# EAGLE design Lock_in (EAGLE 6.4)
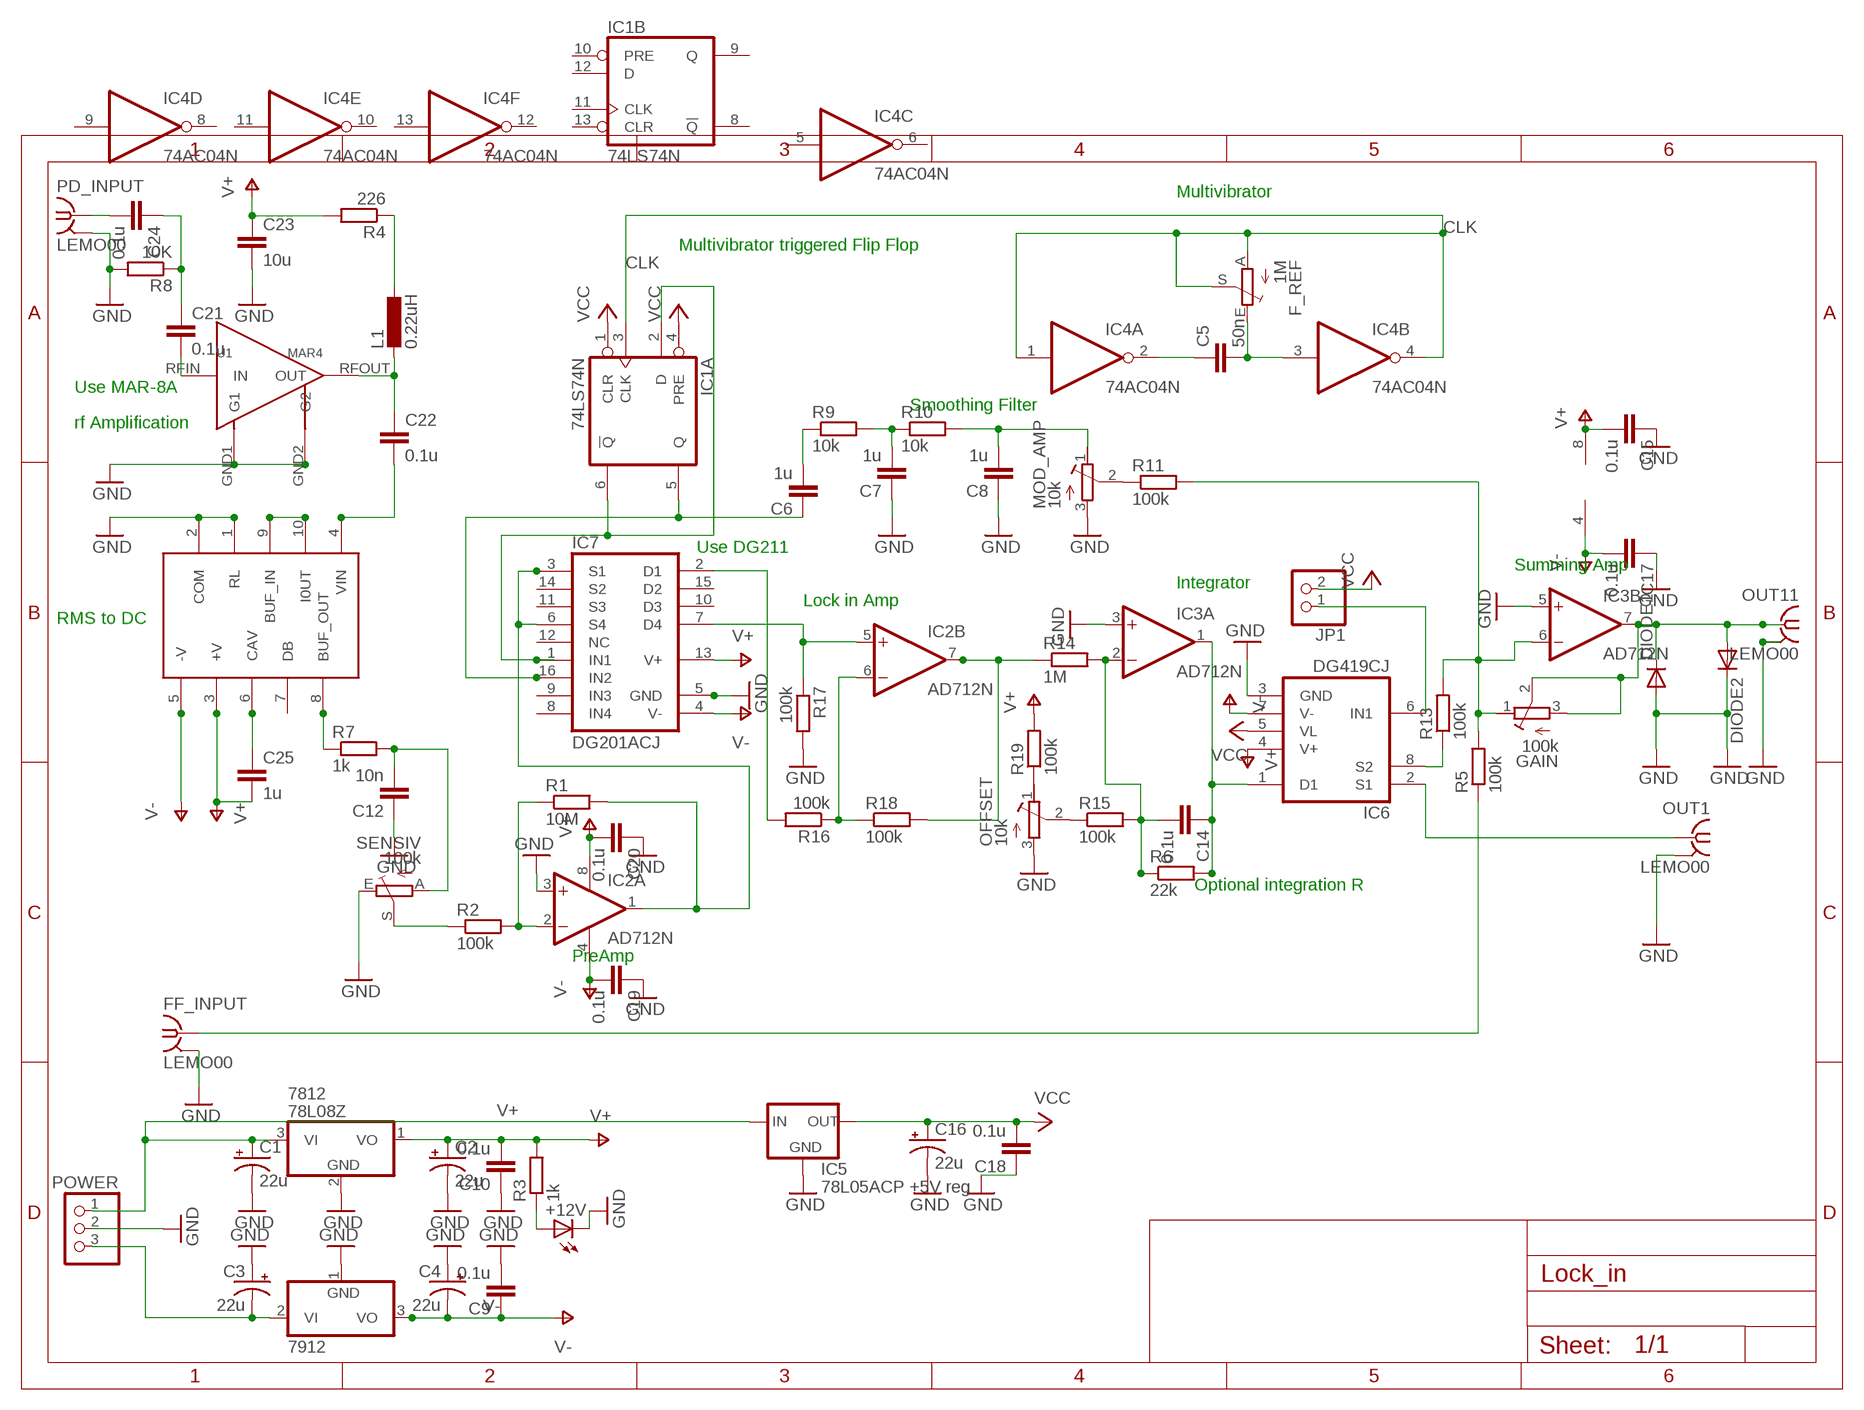
[diagram p0: schematic, sheet 1]

## Parts
7812  78L08Z  [TO92]
7912  79L12Z  [TO92]
+12V  LED5MM  [LED5MM]
C1  22u  CPOL-USE5-4  [E5-4]
C2  22u  CPOL-USE5-4  [E5-4]
C3  22u  CPOL-USE5-4  [E5-4]
C4  22u  CPOL-USE5-4  [E5-4]
C5  50n  C-EU050-024X044  [C050-024X044]
C6  1u  C-EU050-024X044  [C050-024X044]
C7  1u  C-EU050-024X044  [C050-024X044]
C8  1u  C-EU050-024X044  [C050-024X044]
C9  0.1u  C-EU050-024X044  [C050-024X044]
C10  0.1u  C-EU050-024X044  [C050-024X044]
C12  10n  C-EU050-024X044  [C050-024X044]
C14  0.1u  C-EU050-024X044  [C050-024X044]
C15  0.1u  C-EU050-024X044  [C050-024X044]
C16  22u  CPOL-USE5-4  [E5-4]
C17  0.1u  C-EU050-024X044  [C050-024X044]
C18  0.1u  C-EU050-024X044  [C050-024X044]
C19  0.1u  C-EU050-024X044  [C050-024X044]
C20  0.1u  C-EU050-024X044  [C050-024X044]
C21  0.1u  C-EUC0805  [C0805]
C22  0.1u  C-EUC0805  [C0805]
C23  10u  C-EUC1206  [C1206]
C24  0.1u  C-EUC0805  [C0805]
C25  1u  C-EUC0805  [C0805]
DIODE1  1N4004  [DO41-10]
DIODE2  1N4004  [DO41-10]
F_REF  1M  TRIM_EU-S63P  [S63P]
FF_INPUT  LEMO00  [LEMOPAC.PAC]
GAIN  100k  R-TRIMM43P  [RTRIM43P]
IC1  74LS74N  [DIL14]
IC2  AD712N  [DIL08]
IC3  AD712N  [DIL08]
IC4  74AC04N  [DIL14]
IC5  78L05ACP +5V reg  78LXX  [78LXX]
IC6  DG419CJ  [DIL08]
IC7  DG201ACJ  [DIL16]
JP1  PINHD-1X2  [1X02]
L1  0.22uH  L-EUL3216C  [L3216C]
MOD_AMP  10k  R-TRIMM43P  [RTRIM43P]
OFFSET  10k  R-TRIMM43P  [RTRIM43P]
OUT1  LEMO00  [LEMOPAC.PAC]
OUT11  LEMO00  [LEMOPAC.PAC]
PD_INPUT  LEMO00  [LEMOPAC.PAC]
POWER  PINHD-1X3  [1X03]
R1  10M  R-EU_0204/7  [0204/7]
R2  100k  R-EU_0204/7  [0204/7]
R3  1k  R-EU_0204/7  [0204/7]
R4  226  R-EU_R1206  [R1206]
R5  100k  R-EU_0204/7  [0204/7]
R6  22k  R-EU_0204/7  [0204/7]
R7  1k  R-EU_0204/7  [0204/7]
R8  10K  R-EU_R1206  [R1206]
R9  10k  R-EU_0204/7  [0204/7]
R10  10k  R-EU_0204/7  [0204/7]
R11  100k  R-EU_0204/7  [0204/7]
R13  100k  R-EU_0204/7  [0204/7]
R14  1M  R-EU_0204/7  [0204/7]
R15  100k  R-EU_0204/7  [0204/7]
R16  100k  R-EU_0204/7  [0204/7]
R17  100k  R-EU_0204/7  [0204/7]
R18  100k  R-EU_0204/7  [0204/7]
R19  100k  R-EU_0204/7  [0204/7]
SENSIV  100k  TRIM_EU-S63P  [S63P]
U1  MAR4  [VV105]
U$1  AD636  [TO100]

## Nets
CLK: F_REF.A F_REF.S IC1.3(A:CLK) IC4.1(A:I) IC4.4(B:O)
F2: C6.1 IC1.5(A:Q) IC7.16(IN2)
GND: 7812.2(GND) 7912.1(GND) +12V.K(C) C1.- C2.- C3.+ C4.+ C7.1 C8.1 C9.2 C10.1 C12.1 C15.1 C16.- C17.1 C18.1 C19.1 C20.1 C23.2 DIODE1.A DIODE2.C FF_INPUT.2(GND) FF_INPUT.3(GND) FF_INPUT.4(GND) FF_INPUT.5(GND) IC2.3(A:+IN) IC3.3(A:+IN) IC3.5(B:+IN) IC5.GND IC6.3(GND) IC7.5(GND) MOD_AMP.3(E) OFFSET.3(E) OUT1.2(GND) OUT1.3(GND) OUT1.4(GND) OUT1.5(GND) OUT11.2(GND) OUT11.3(GND) OUT11.4(GND) OUT11.5(GND) PD_INPUT.2(GND) PD_INPUT.3(GND) PD_INPUT.4(GND) PD_INPUT.5(GND) POWER.2 R8.2 R17.2 SENSIV.E U1.GND1(G1) U1.GND2(G2) U$1.1(RL) U$1.2(COM)
GND1: IC6.6(IN1) JP1.1
MOD_AMPLITUDE: C8.2 MOD_AMP.1(A) R10.2
N$1: C5.1 IC4.2(A:O)
N$2: +12V.A R3.1
N$3: DIODE1.C DIODE2.A GAIN.2(S) GAIN.3(E) IC3.7(B:OUT) OUT11.1
N$4: IC2.2(A:-IN) R1.1 R2.2
N$5: C5.2 F_REF.E IC4.3(B:I)
N$6: R2.1 SENSIV.S
N$9: C12.2 R7.2 SENSIV.A
N$10: R7.1 U$1.8(BUF_OUT)
N$12: C6.2 R9.1
N$13: C7.2 R9.2 R10.1
N$14: GAIN.1(A) IC3.6(B:-IN) R5.2 R11.2 R13.2
N$15: MOD_AMP.2(S) R11.1
N$16: IC2.1(A:OUT) IC7.3(S1) IC7.6(S4) R1.2
N$18: OFFSET.1(A) R19.1
N$19: IC6.8(S2) R13.1
N$20: IC1.2(A:D) IC1.6(A:!Q) IC7.1(IN1)
N$21: C14.2 IC3.2(A:-IN) R6.1 R14.2 R15.2
N$22: IC7.2(D1) R16.2
N$23: IC2.5(B:+IN) IC7.7(D4) R17.1
N$24: IC2.6(B:-IN) R16.1 R18.1
N$25: IC2.7(B:OUT) R14.1 R18.2
N$26: OFFSET.2(S) R15.1
N$27: C21.2 U1.RFIN(IN)
N$28: C14.1 IC3.1(A:OUT) IC6.1(D1) R6.2
N$29: L1.1 R4.1
N$30: C22.1 L1.2 U1.RFOUT(OUT)
N$32: C24.2 PD_INPUT.1
N$33: C21.1 C24.1 R8.1
N$34: C22.2 U$1.4(VIN)
N$35: IC6.2(S1) OUT1.1
N$37: U$1.9(BUF_IN) U$1.10(I0UT)
N$38: C25.1 U$1.6(CAV)
OUT: FF_INPUT.1 R5.1
V+: 7812.1(VO) C2.+ C10.2 C15.2 C20.2 C23.1 C25.2 IC2.8(P:V+) IC3.8(P:V+) IC6.4(V+) IC7.13(V+) R3.2 R4.2 R19.2 U$1.3(+V)
V+INPUT: 7812.3(VI) C1.+ IC5.IN POWER.1
V-: 7912.3(VO) C4.- C9.1 C17.2 C19.2 IC2.4(P:V-) IC3.4(P:V-) IC6.7(V-) IC7.4(V-) U$1.5(-V)
V-INPUT: 7912.2(VI) C3.- POWER.3
VCC: C16.+ C18.2 IC1.1(A:CLR) IC1.4(A:PRE) IC5.OUT IC6.5(VL) JP1.2
Unconnected: IC1.8(B:!Q) IC1.9(B:Q) IC1.10(B:PRE) IC1.11(B:CLK) IC1.12(B:D) IC1.13(B:CLR) IC4.5(C:I) IC4.6(C:O) IC4.8(D:O) IC4.9(D:I) IC4.10(E:O) IC4.11(E:I) IC4.12(F:O) IC4.13(F:I) IC7.8(IN4) IC7.9(IN3) IC7.10(D3) IC7.11(S3) IC7.12(NC) IC7.14(S2) IC7.15(D2) U$1.7(DB)

## Notes on the sheet
- Multivibrator
- Multivibrator triggered Flip Flop
- Use MAR-8A
- Smoothing Filter
- rf Amplification
- Use DG211
- Summing Amp
- Integrator
- Lock in Amp
- RMS to DC
- Optional integration R
- PreAmp

## Power pins joined to a net without a drawn wire
GND: IC1.7(P:GND) IC4.7(P:GND)
VCC: IC1.14(P:VCC) IC4.14(P:VCC)

## Library data of the parts
7812 = linear:78*: Positive VOLTAGE REGULATOR Source: http://cache.national.com/ds/LM/LM78L05.pdf http://www.fairchildsemi.com/ds/LM/LM7805.pdf
7912 = linear:79*: Negative VOLTAGE REGULATOR
+12V = led:LED: LED OSRAM: - CHIPLED LG R971, LG N971, LY N971, LG Q971, LY Q971, LO R971, LY R971 LH N974, LH R974 LS Q976, LO Q976, LY Q976 LO Q996 - Hyper CHIPLED LW Q18S LB Q993, LB Q99A, LB R99A - SideLED LS A670, LO A670, LY A670, LG A670, LP A670 LB A673, LV A673, LT A673, LW A673 LH A674 LY A675 LS A676, LA A676, LO A676, LY A676, LW A676 LS A679, LY A679, LG A679 - Hyper Micro SIDELED® LS Y876, LA Y876, LO Y876, LY Y876 LT Y87S - SmartLED LW L88C, LW L88S LB L89C, LB L89S, LG L890 LS L89K, LO L89K, LY L89K LS L896, LA L896, LO L896, LY L896 - TOPLED LS T670, LO T670, LY T670, LG T670, LP T670 LSG T670, LSP T670, LSY T670, LOP T670, LYG T670 LG T671, LOG T671, LSG T671 LB T673, LV T673, LT T673, LW T673 LH T674 LS T676, LA T676, LO T676, LY T676, LB T676, LH T676, LSB T676, LW T676 LB T67C, LV T67C, LT T67C, LS T67K, LO T67K, LY T67K, LW E67C LS E67B, LA E67B, LO E67B, LY E67B, LB E67C, LV E67C, LT E67C LW T67C LS T679, LY T679, LG T679 LS T770, LO T770, LY T770, LG T770, LP T770 LB T773, LV T773, LT T773, LW T773 LH T774 LS E675, LA E675, LY E675, LS T675 LS T776, LA T776, LO T776, LY T776, LB T776 LHGB T686 LT T68C, LB T68C - Hyper Mini TOPLED® LB M676 - Mini TOPLED Santana® LG M470 LS M47K, LO M47K, LY M47K Source: http://www.osram.convergy.de LUXEON: - LUMILED® LXK2-PW12-R00, LXK2-PW12-S00, LXK2-PW14-U00, LXK2-PW14-V00 LXK2-PM12-R00, LXK2-PM12-S00, LXK2-PM14-U00 LXK2-PE12-Q00, LXK2-PE12-R00, LXK2-PE12-S00, LXK2-PE14-T00, LXK2-PE14-U00 LXK2-PB12-K00, LXK2-PB12-L00, LXK2-PB12-M00, LXK2-PB14-N00, LXK2-PB14-P00, LXK2-PB14-Q00 LXK2-PR12-L00, LXK2-PR12-M00, LXK2-PR14-Q00, LXK2-PR14-R00 LXK2-PD12-Q00, LXK2-PD12-R00, LXK2-PD12-S00 LXK2-PH12-R00, LXK2-PH12-S00 LXK2-PL12-P00, LXK2-PL12-Q00, LXK2-PL12-R00 Source: www.luxeon.com KINGBRIGHT: KA-3528ASYC Source: www.kingbright.com
C1-C4 C16 = rcl:CPOL-US: POLARIZED CAPACITOR, American symbol
C5-C10 C12 C14 C15 C17-C25 = rcl:C-EU: CAPACITOR, European symbol
DIODE1 DIODE2 = diode:1N4004: DIODE general purpose rectifier, 1 A
F_REF SENSIV = pot:TRIM_EU-: POTENTIOMETER
FF_INPUT OUT1 OUT11 PD_INPUT = con-coax:LEMO00
GAIN MOD_AMP OFFSET = resistor:R-TRIMM: Trimm resistor
IC1 = 74xx-eu:74*74: Dual D type positive edge triggered FLIP FLOP, preset and clear
IC2 IC3 = linear:AD712: OP AMP
IC4 = 74xx-eu:74*04: Hex INVERTER
IC5 = v-reg:78LXX: VOLTAGE REGULATOR
IC6 = maxim:DG419CJ: ANALOG SWITCH; MF: MAXIM; MPN: DG419CJ; OC_FARNELL: unknown; OC_NEWARK: 77C6520
IC7 = maxim:DG201ACJ: ANALOG SWITCH; MPN: DG201ACJ; OC_FARNELL: unknown; OC_NEWARK: 06F3941
JP1 = pinhead:PINHD-1X2: PIN HEADER
L1 = rcl:L-EU: INDUCTOR, European symbol
POWER = pinhead:PINHD-1X3: PIN HEADER
R1-R11 R13-R19 = rcl:R-EU_: RESISTOR, European symbol
U1 = custom_parts:MAR4: MiniCircuits MAR4 (and other) amplifier
U$1 = analog-devices:AD636

## Board
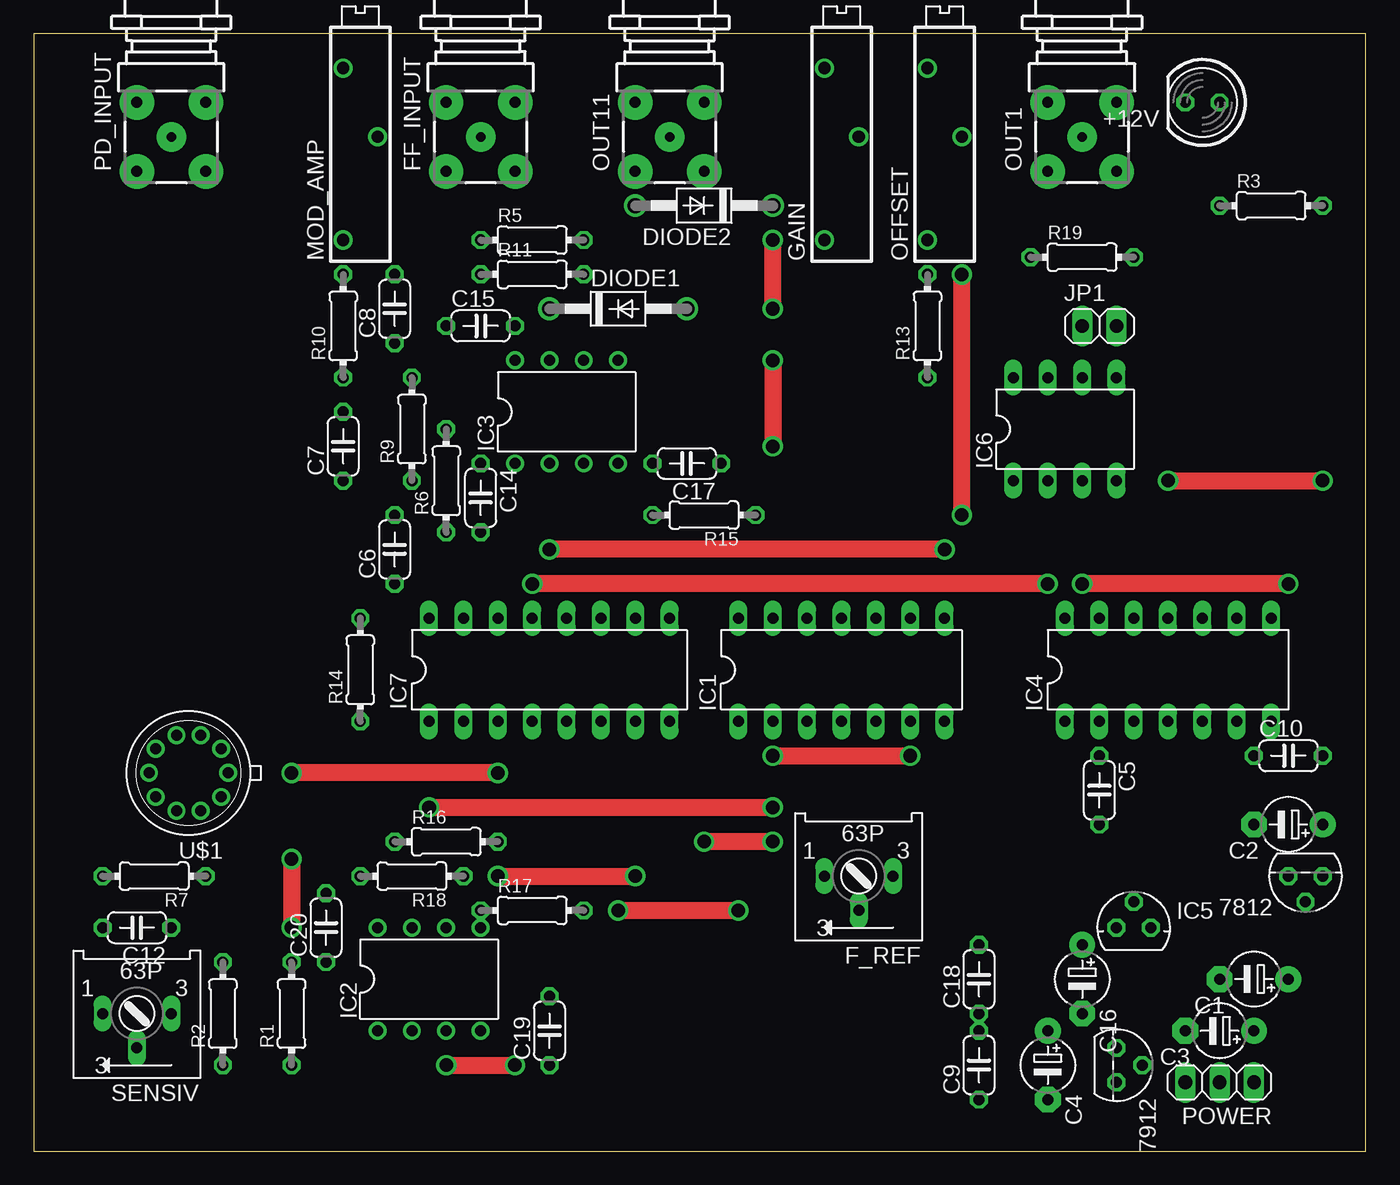
[diagram p1: board, top side]
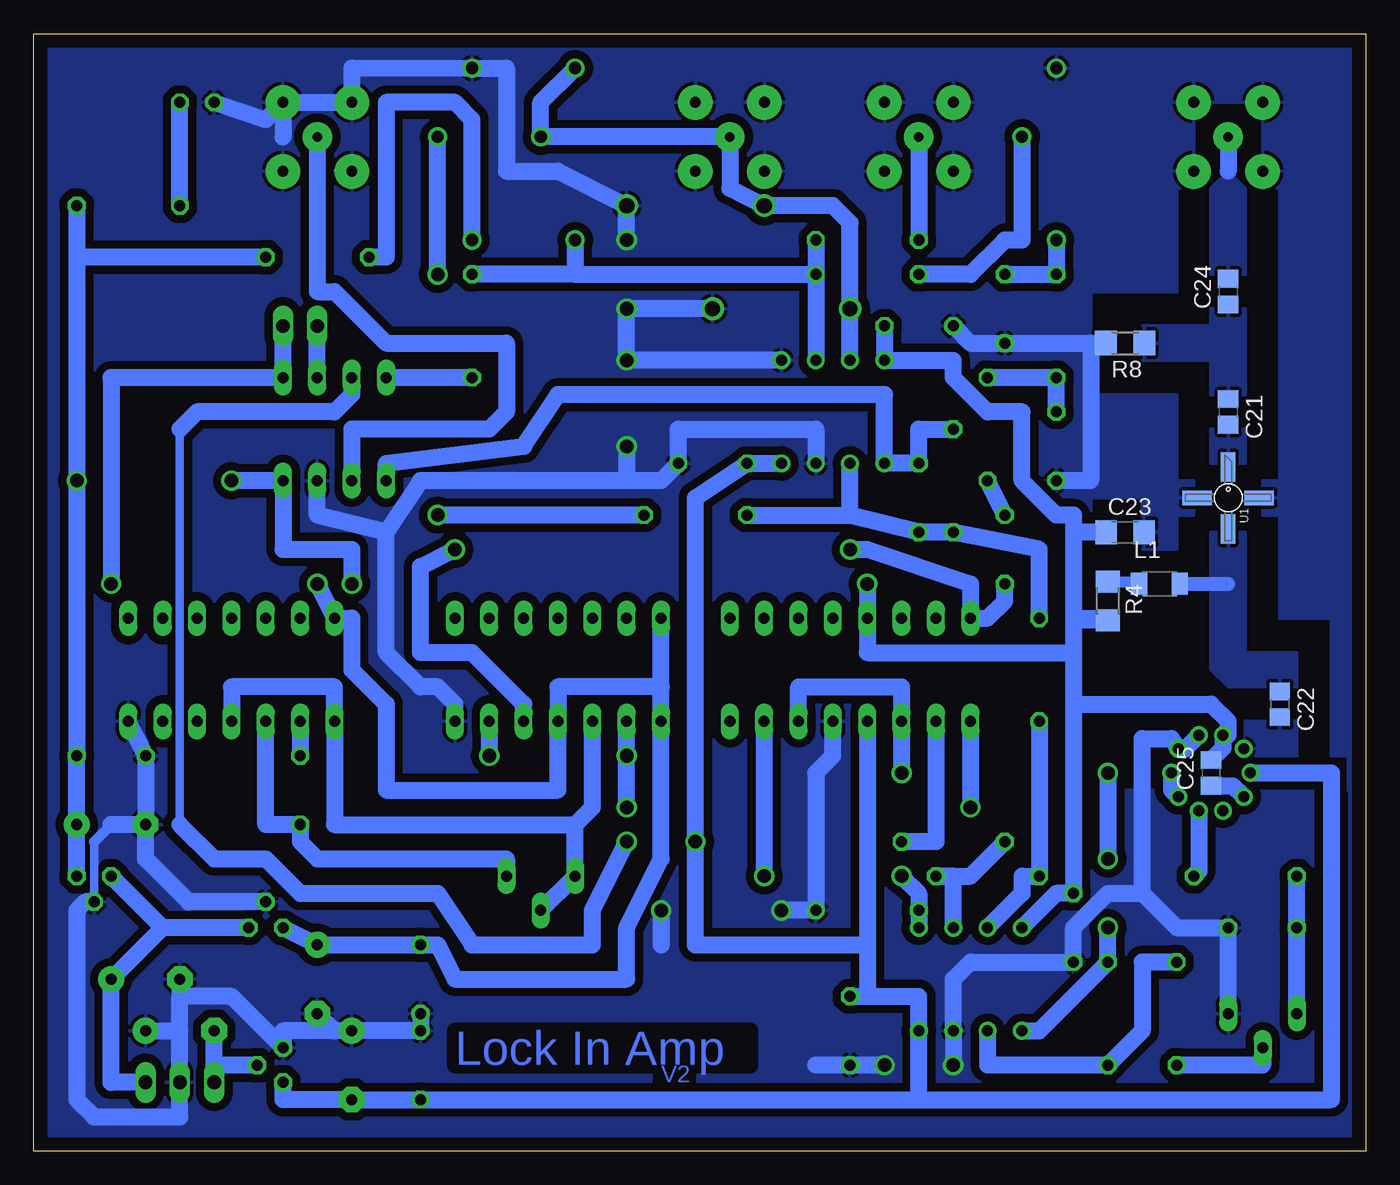
[diagram p2: board, bottom side, seen from below]

Size 98.42 x 82.54 mm. Coordinates in mm from the lower left corner, seen from the top.
Outline: 0,0 98.42,0 98.42,82.54 0,82.54 0,0
Copper layers (1*16): Top 0.035mm / dielectric 1.5mm / Bottom 0.035mm
Design rules "default": minimum track width 10mil, minimum drill 24mil, track to track 8mil, track to pad 8mil, pad to pad 8mil, via to via 8mil, smd to smd 8mil, copper to edge 40mil, drill to drill 8mil, minimum pad ring 10mil, minimum via ring 8mil, stop-mask expansion 4mil, vias tented up to drill 0mil, thermal gap 10mil

### Footprints (pad centres in the part's own frame; a part is rotated, then mirrored left to right if it is on the bottom)
TO92 = drill 0.813 octagon: 1 -1.27,0; 2 0,1.905; 3 1.27,0
LED5MM = drill 0.813 octagon: A -1.27,0; K 1.27,0
E5-4 = drill 0.813 pad 1.905: + -2.54,0 | drill 0.813 pad 1.905 octagon: - 2.54,0
C050-024X044 = drill 0.813 octagon: 1 -2.54,0; 2 2.54,0
C0805 = smd 1.3 x 1.5: 1 -0.95,0; 2 0.95,0
C1206 = smd 1.6 x 1.8: 1 -1.4,0; 2 1.4,0
DO41-10 = drill 1.118: A 5.08,0; C -5.08,0
S63P = drill 0.813 long: A 2.54,0; E -2.54,0; S 0,2.54
LEMOPAC.PAC = drill 0.7 pad 2.184: 1 0,0 | drill 0.8 pad 2.54: 2 -2.55,2.55; 3 2.55,2.55; 4 2.55,-2.55; 5 -2.55,-2.55
RTRIM43P = drill 0.9: 1 -7.62,1.27; 2 0,-1.27; 3 5.08,1.27
DIL14 = drill 0.813 long: 1 -7.62,-3.81; 2 -5.08,-3.81; 3 -2.54,-3.81; 4 0,-3.81; 5 2.54,-3.81; 6 5.08,-3.81; 7 7.62,-3.81; 8 7.62,3.81; 9 5.08,3.81; 10 2.54,3.81; 11 0,3.81; 12 -2.54,3.81; 13 -5.08,3.81; 14 -7.62,3.81
DIL08 = drill 0.813 pad 1.27: 1 -3.81,-3.81; 2 -1.27,-3.81; 3 1.27,-3.81; 4 3.81,-3.81; 5 3.81,3.81; 6 1.27,3.81; 7 -1.27,3.81; 8 -3.81,3.81
78LXX = drill 0.813 octagon: GND 0,1.905; IN 1.27,0; OUT -1.27,0
DIL08' = drill 0.813 long: 1 -3.81,-3.81; 2 -1.27,-3.81; 3 1.27,-3.81; 4 3.81,-3.81; 5 3.81,3.81; 6 1.27,3.81; 7 -1.27,3.81; 8 -3.81,3.81
DIL16 = drill 0.813 long: 1 -8.89,-3.81; 2 -6.35,-3.81; 3 -3.81,-3.81; 4 -1.27,-3.81; 5 1.27,-3.81; 6 3.81,-3.81; 7 6.35,-3.81; 8 8.89,-3.81; 9 8.89,3.81; 10 6.35,3.81; 11 3.81,3.81; 12 1.27,3.81; 13 -1.27,3.81; 14 -3.81,3.81; 15 -6.35,3.81; 16 -8.89,3.81
1X02 = drill 1.016 long: 1 -1.27,0; 2 1.27,0
L3216C = smd 1.2 x 1.6: 1 -1.5,0; 2 1.5,0
1X03 = drill 1.016 long: 1 -2.54,0; 2 0,0; 3 2.54,0
0204/7 = drill 0.813 octagon: 1 -3.81,0; 2 3.81,0
R1206 = smd 1.6 x 1.803: 1 -1.422,0; 2 1.422,0
VV105 = smd 1.067 x 2.184: GND1 0,2.286; GND2 0,-2.286 | smd 2.184 x 1.067: RFIN -2.286,0; RFOUT 2.286,0
TO100 = drill 0.813: 1 -2.413,-1.778; 2 -0.889,-2.794; 3 0.889,-2.794; 4 2.413,-1.778; 5 2.921,0; 6 2.413,1.778; 7 0.889,2.794; 8 -0.889,2.794; 9 -2.413,1.778; 10 -2.921,0

### Placement (x,y rotation side)
7812  93.98,20.32 180 top
7912  80.01,6.35 270 top
+12V  86.36,77.47 180 top
C1  90.17,12.7 180 top
C2  92.71,24.13 180 top
C3  87.63,8.89 180 top
C4  74.93,6.35 270 top
C5  78.74,26.67 270 top
C6  26.67,44.45 90 top
C7  22.86,52.07 90 top
C8  26.67,62.23 90 top
C9  69.85,6.35 90 top
C10  92.71,29.21 0 top
C12  7.62,16.51 180 top
C14  33.02,48.26 270 top
C15  33.02,60.96 0 top
C16  77.47,12.7 270 top
C17  48.26,50.8 180 top
C18  69.85,12.7 90 top
C19  38.1,8.89 90 top
C20  21.59,16.51 90 top
C21  10.16,54.61 270 bottom
C22  6.35,33.02 270 bottom
C23  17.78,45.72 0 bottom
C24  10.16,63.5 90 bottom
C25  11.43,27.94 90 bottom
DIODE1  43.18,62.23 0 top
DIODE2  49.53,69.85 180 top
F_REF  60.96,20.32 180 top
FF_INPUT  33.02,74.93 90 top
GAIN  59.69,74.93 90 top
IC1  59.69,35.56 0 top
IC2  29.21,12.7 0 top
IC3  39.37,54.61 0 top
IC4  83.82,35.56 0 top
IC5  81.28,16.51 0 top
IC6  DG419CJ  [DIL08']  76.2,53.34 0 top
IC7  38.1,35.56 0 top
JP1  78.74,60.96 0 top
L1  15.24,41.91 0 bottom
MOD_AMP  24.13,74.93 90 top
OFFSET  67.31,74.93 90 top
OUT1  77.47,74.93 90 top
OUT11  46.99,74.93 90 top
PD_INPUT  10.16,74.93 90 top
POWER  87.63,5.08 180 top
R1  19.05,10.16 90 top
R2  13.97,10.16 90 top
R3  91.44,69.85 0 top
R4  19.05,40.64 270 bottom
R5  36.83,67.31 0 top
R6  30.48,49.53 90 top
R7  8.89,20.32 180 top
R8  17.78,59.69 180 bottom
R9  27.94,53.34 90 top
R10  22.86,60.96 90 top
R11  36.83,64.77 0 top
R13  66.04,60.96 90 top
R14  24.13,35.56 90 top
R15  49.53,46.99 180 top
R16  30.48,22.86 0 top
R17  36.83,17.78 0 top
R18  27.94,20.32 180 top
R19  77.47,66.04 0 top
SENSIV  7.62,10.16 180 top
U1  10.16,48.26 270 bottom
U$1  11.43,27.94 180 top

### Tracks (layer width: path | path; a pad name or v marks a point on that pad's centre or on a via)
CLK
  Bottom 1.27: F_REF.S F_REF.A 58.42,24.13 | IC4.4 83.82,34.29 76.2,34.29 IC4.1 76.2,24.13 58.42,24.13 | 58.42,24.13 57.15,25.4 IC1.3
F2  (via drill 1)
  Top 1.27: v67.31,44.45 v38.1,44.45
  Bottom 1.27: C6.1 26.67,40.64 27.94,39.37 IC7.16 29.21,41.91 36.83,44.45 v38.1,44.45 | IC1.5 62.23,33.02 66.04,36.83 69.85,36.83 69.85,43.18 v67.31,44.45
GND  (via drill 1)
  Top 1.27: v54.61,62.23 v54.61,67.31 | v43.18,17.78 v52.07,17.78 | v30.48,6.35 v35.56,6.35 | v54.61,58.42 v54.61,52.07
  Bottom 0.61: 94.61,18.41 93.98,19.05 93.98,22.86
  Bottom 0.762: 92.71,24.13 93.98,22.86
  Bottom 1.27: 87.63,8.89 POWER.2 87.63,2.54 93.98,2.54 95.25,3.81 95.25,17.78 94.61,18.41 7812.2 | C3.+ 87.63,8.89 | 87.63,8.89 87.63,11.43 | C1.- 87.63,11.43 | 76.2,8.89 C4.+ C9.2 C18.1 | 76.2,8.89 80.01,8.89 7912.1 83.82,11.43 87.63,11.43 | C16.- 76.2,8.89 | IC4.7 C10.1 C2.- | C2.- 92.71,24.13 | IC1.7 67.31,33.02 68.58,34.29 69.85,34.29 72.39,36.83 72.39,45.72 | SENSIV.E C12.1 13.97,16.51 16.51,19.05 | 72.39,45.72 77.47,46.99 IC6.3 | 16.51,19.05 16.51,30.48 14.35,30.48 U$1.1 13.34,29.72 U$1.2 | C15.1 29.21,59.69 C8.1 20.32,59.69 | 20.32,59.69 20.32,49.53 C7.1 | IC7.5 39.37,29.21 40.64,27.94 R17.2 v43.18,17.78 | +12V.K 81.28,76.2 OUT1.4 | OUT1.4 80.01,74.93 | OUT1.4 OUT1.3 74.92,80.02 OFFSET.3 63.5,80.01 63.5,72.39 59.69,72.39 DIODE2.C v54.61,67.31 | IC5.GND 87,18.41 90.17,21.59 C2.- | 72.39,45.72 69.85,49.53 54.61,49.53 | DIODE1.A v54.61,62.23 v54.61,58.42 IC3.5 | 40.64,6.35 C19.1 v35.56,6.35 | v30.48,6.35 IC2.3 30.48,12.7 29.21,13.97 C20.1 21.59,16.51 19.05,19.05 16.51,19.05 | 20.32,59.69 R8.2 | 54.61,49.53 52.07,49.53 C17.1 50.8,53.34 40.64,53.34 IC3.3 | v54.61,52.07 54.61,49.53 | v52.07,17.78 52.07,15.24
  pour Bottom: 0,26.67 1.27,26.67 1.27,29.21 2.54,29.21 2.54,39.37 6.35,39.37 6.35,46.99 7.62,46.99 7.62,49.53 6.35,49.53 6.35,71.12 7.62,71.12 7.62,82.55 0,82.55
  pour Bottom: 7.62,77.47 7.62,82.55 20.32,82.55 20.32,63.5 13.97,63.5 13.97,71.12 12.7,71.12 12.7,77.47
  pour Bottom: 16.51,55.88 13.97,55.88 13.97,49.53 12.7,49.53 12.7,46.99 13.97,46.99 13.97,44.45 16.51,44.45
  pour Bottom (isolate 0.61): 0,26.67 0,0 99.06,0 99.06,82.55 20.32,82.55 20.32,26.67
  pour Bottom: 16.51,55.88 20.32,55.88 20.32,48.26 16.51,48.26
GND1
  Bottom 1.27: IC6.6 JP1.1
MOD_AMPLITUDE
  Bottom 1.27: C8.2 R10.2 MOD_AMP.1
N$1
  Bottom 1.27: IC4.2 C5.1
N$2
  Bottom 1.27: R3.1 +12V.A
N$3
  Bottom 1.27: IC3.7 DIODE1.C 38.1,68.58 39.37,69.85 DIODE2.A 46.99,71.12 OUT11.1 GAIN.2 60.96,77.47 GAIN.3
N$4
  Bottom 1.27: IC2.2 27.94,6.35 R1.1 16.51,8.89 16.51,13.97 R2.2
N$5
  Bottom 1.27: IC4.3 81.28,24.13 C5.2 78.74,22.86 77.47,21.59 63.5,21.59 F_REF.E
N$6
  Bottom 1.27: SENSIV.S 7.62,6.35 R2.1
N$9
  Bottom 1.27: SENSIV.A C12.2 R7.2
N$10
  Bottom 1.27: U$1.8 12.32,20.7 R7.1
N$12
  Bottom 1.27: C6.2 R9.1
N$13
  Bottom 1.27: C7.2 R10.1 R9.2
N$14
  Bottom 1.27: R5.2 R11.2 | R11.2 IC3.6 | 58.42,64.77 R13.2 | GAIN.1 58.42,64.77 | 58.42,64.77 R11.2
N$15
  Bottom 1.27: MOD_AMP.2 25.4,67.31 26.67,67.31 29.21,64.77 R11.1
N$16  (via drill 1)
  Top 1.27: v34.29,27.94 v19.05,27.94 | v19.05,21.59 v19.05,16.51
  Bottom 1.27: v34.29,27.94 IC7.3 34.29,34.29 41.91,34.29 IC7.6 | IC2.1 24.13,8.89 R1.2 v19.05,16.51 | v19.05,27.94 v19.05,21.59
N$18
  Bottom 1.27: OFFSET.1 66.04,76.2 67.31,77.47 72.39,77.47 72.39,66.04 R19.1
N$19
  Bottom 1.27: R13.1 IC6.8
N$20  (via drill 1)
  Top 1.27: v29.21,25.4 v54.61,25.4 | v54.61,29.21 v64.77,29.21
  Bottom 1.27: IC7.1 v29.21,25.4 | v54.61,25.4 v54.61,29.21 IC1.2 | IC1.6 v64.77,29.21
N$21
  Bottom 1.27: R14.2 24.13,44.45 R6.1 C14.2 38.1,46.99 | R15.2 38.1,46.99 | 38.1,46.99 IC3.2
N$22
  Bottom 1.27: IC7.2 31.75,22.86 R16.2
N$23  (via drill 1)
  Top 1.27: v34.29,20.32 v44.45,20.32
  Bottom 1.27: v34.29,20.32 33.02,19.05 R17.1 IC2.5 | IC7.7 v44.45,20.32
N$24
  Bottom 1.27: IC2.6 30.48,20.32 R18.1 29.21,20.32 R16.1
N$25
  Bottom 1.27: R14.1 R18.2 25.4,20.32 25.4,19.05 IC2.7
N$26  (via drill 1)
  Top 1.27: v68.58,46.99 v68.58,64.77
  Bottom 1.27: R15.1 v68.58,46.99 | v68.58,64.77 OFFSET.2
N$27
  pour Bottom: 11.43,53.34 8.89,53.34 8.89,50.8 11.43,50.8
N$28
  Bottom 1.27: R6.2 33.02,53.34 C14.1 IC3.1 35.56,55.88 59.69,55.88 62.23,52.07 72.39,50.8 IC6.1
N$29
  Bottom 0.813: R4.1 16.74,42.06 L1.1
N$30
  Bottom 1.016: L1.2 10.16,41.91
  pour Bottom: 11.43,45.72 8.89,45.72 8.89,36.83 5.08,36.83 5.08,34.29 10.16,34.29 11.43,35.56
N$32
  Bottom 1.27: PD_INPUT.1 10.16,72.39
  pour Bottom: 10.16,72.39 11.43,71.12 11.43,64.77 8.89,64.77 8.89,71.12
N$33
  pour Bottom: 16.51,60.96 16.51,58.42 11.43,58.42 11.43,60.96
  pour Bottom: 10.16,62.23 8.89,62.23 8.89,55.88 11.43,55.88 11.43,62.23
N$34
  pour Bottom: 5.08,31.75 8.89,31.75 8.89,29.21 5.08,29.21
N$35
  Bottom 1.27: OUT1.1 77.47,63.5 76.2,63.5 72.39,59.69 63.5,59.69 63.5,54.61 64.77,53.34 74.93,53.34 IC6.2
N$37
  Bottom 1.27: U$1.10 14.35,26.67 U$1.9
N$38
  Bottom 1.27: C25.1 9.85,26.99 U$1.6
OUT
  Bottom 1.27: FF_INPUT.1 R5.1
V+  (via drill 1)
  Top 1.27: v83.82,49.53 v95.25,49.53 | v74.93,41.91 v36.83,41.91
  Bottom 1.27: C25.2 10.54,29.78 U$1.3 10.16,30.73 10.16,31.75 11.43,33.02 21.59,33.02 | 7812.1 C2.+ C10.2 v95.25,49.53 95.25,66.04 | R3.2 95.25,66.04 | v83.82,49.53 IC6.4 80.01,44.45 74.93,44.45 v74.93,41.91 | IC7.13 v36.83,41.91 36.83,36.83 21.59,36.83 | C15.2 IC3.8 30.48,58.42 30.48,57.15 27.94,54.61 25.4,54.61 25.4,49.53 22.86,46.99 21.59,46.99 21.59,45.72 | 21.59,45.72 21.59,39.37 19.2,39.37 R4.2 21.59,39.22 21.59,36.83 | R19.2 95.25,66.04 | IC2.8 22.86,19.05 C20.2 21.59,33.02 | 21.59,36.83 21.59,33.02 | C23.1 21.59,45.72
V+INPUT
  Bottom 1.27: POWER.1 92.71,5.08 C1.+ 88.9,16.51 | IC5.IN 88.9,16.51 | 88.9,16.51 7812.3
V-  (via drill 1)
  Top 1.27: v54.61,22.86 v49.53,22.86
  Bottom 0.61: 87.63,53.34 87.63,24.13
  Bottom 1.27: 7912.3 80.01,3.81 C4.- C9.1 33.02,3.81 | 33.02,3.81 2.54,3.81 2.54,27.94 U$1.5 | IC3.4 C17.2 49.53,48.26 v49.53,22.86 49.53,15.24 36.83,15.24 | C19.2 36.83,11.43 | 36.83,11.43 33.02,11.43 IC2.4 33.02,3.81 | IC6.7 74.93,55.88 76.2,54.61 86.36,54.61 87.63,53.34 | 87.63,24.13 85.09,21.59 81.28,21.59 78.74,19.05 68.58,19.05 66.04,15.24 57.15,15.24 57.15,17.78 v54.61,22.86 | IC7.4 36.83,15.24 | 36.83,15.24 36.83,11.43
V-INPUT
  Bottom 1.27: POWER.3 85.09,6.35 | 85.09,6.35 C3.- | 7912.2 85.09,6.35
VCC  (via drill 1)
  Top 1.27: v92.71,41.91 v77.47,41.91
  Bottom 1.27: IC5.OUT C16.+ C18.2 68.58,15.24 67.31,12.7 54.61,12.7 54.61,16.51 52.07,21.59 IC1.1 52.07,34.29 | 52.07,34.29 59.69,34.29 IC1.4 59.69,26.67 72.39,26.67 72.39,33.02 74.93,35.56 74.93,39.37 IC4.14 v77.47,41.91 | 52.07,34.29 IC1.14 | JP1.2 IC6.5 92.71,57.15 v92.71,41.91

### Text on the board
Bottom: Lock In Amp | V2